# Altium schematic sheet MCP23017-1.SchDoc
size B
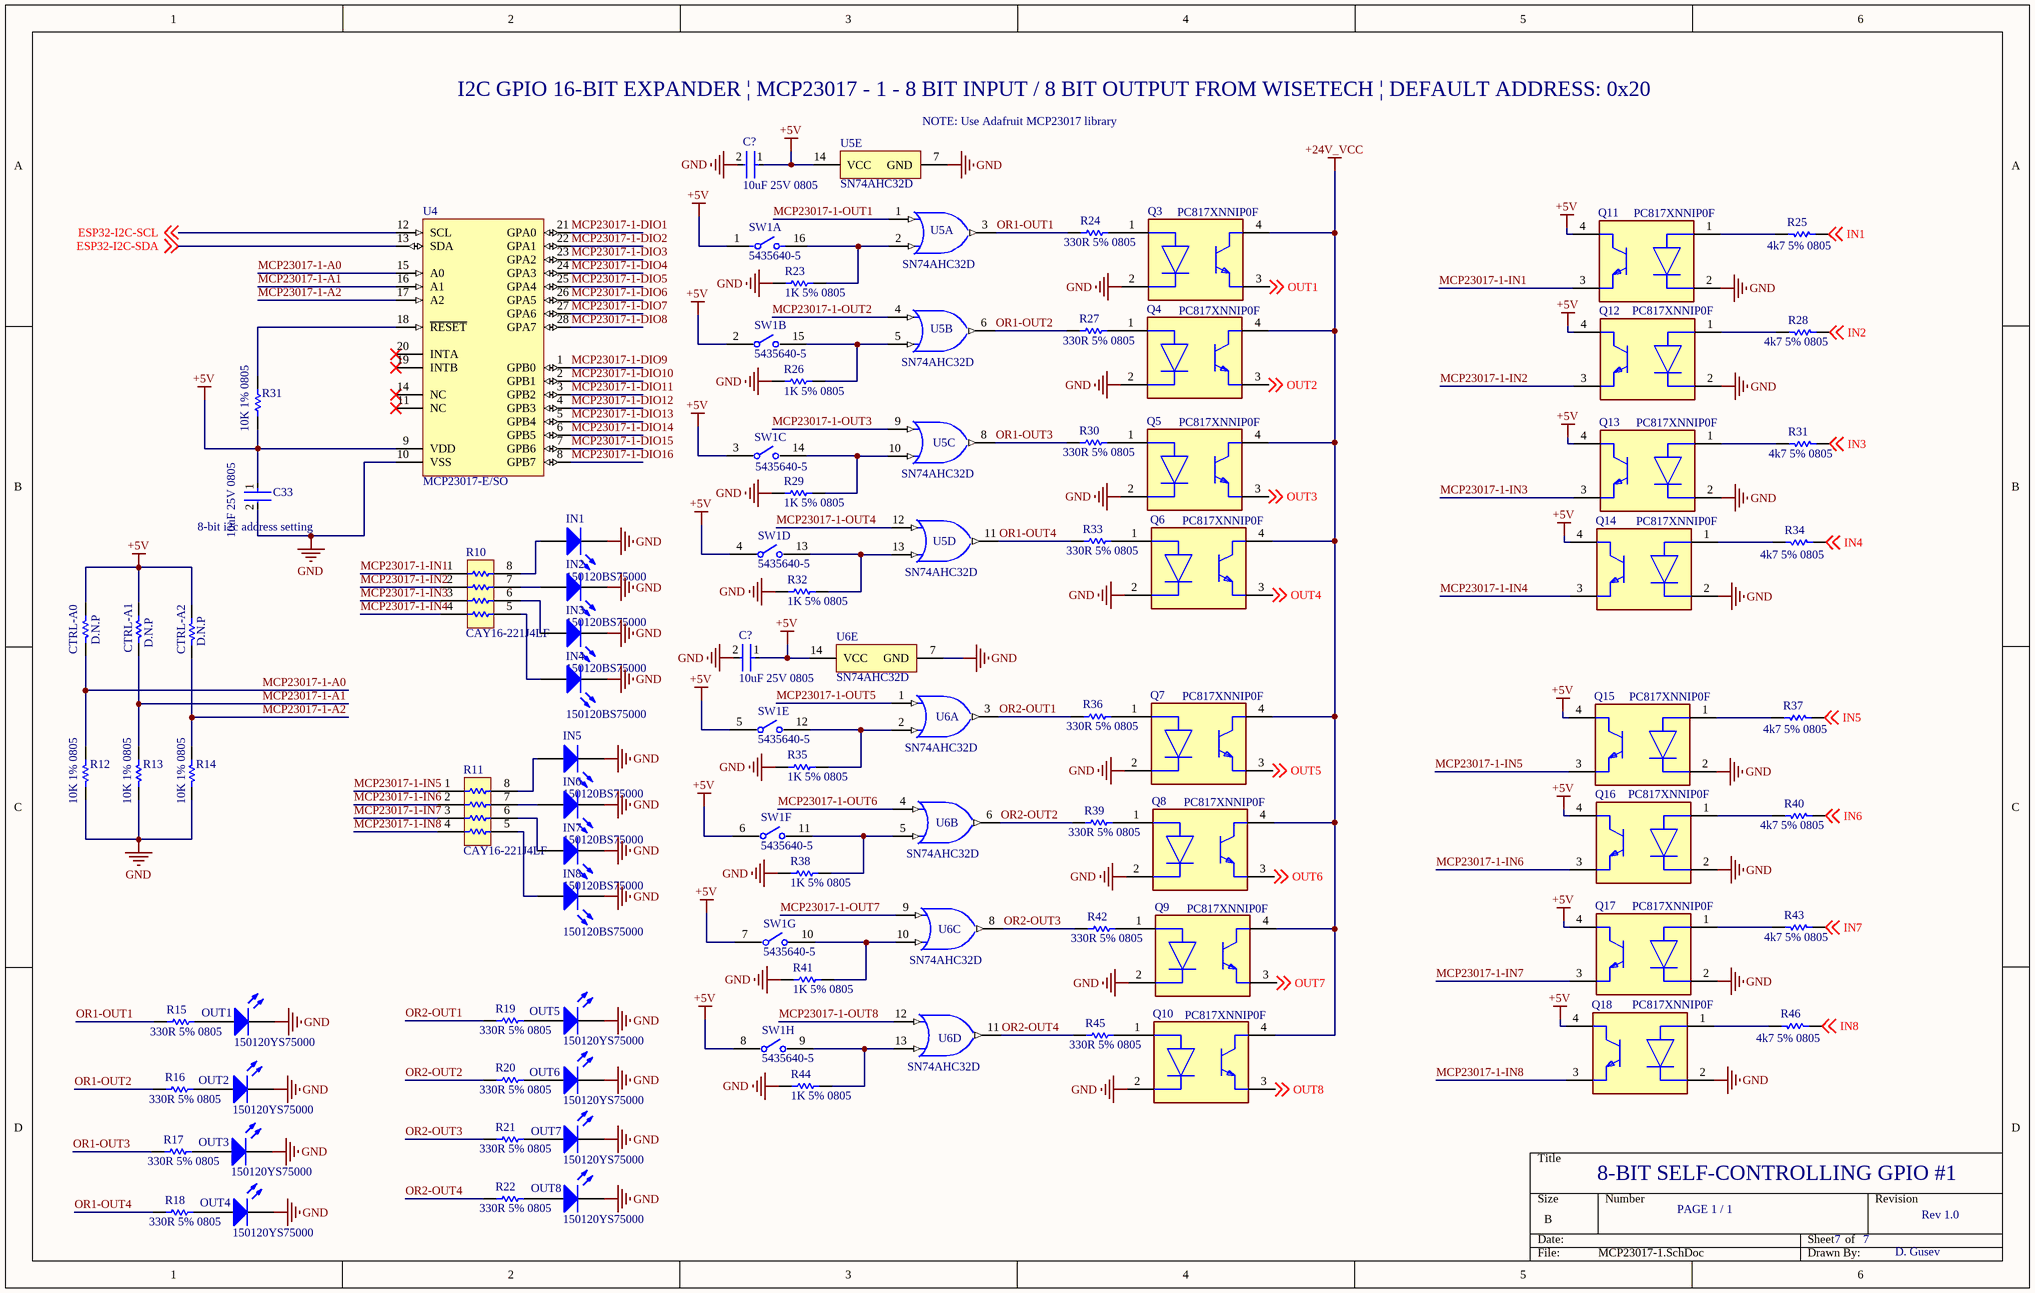
[diagram p0: MCP23017-1.SchDoc]

## Parts
(Parts that share a designator on the sheet are numbered #1, #2 ... from top to bottom, then left to right.)
C33  10uF 25V 0805  [FP-GRM21B-0_15-IPC_B]
C?#1  10uF 25V 0805  [FP-GRM21B-0_15-IPC_B]
C?#2  10uF 25V 0805  [FP-GRM21B-0_15-IPC_B]
CTRL-A0  D.N.P  [RESC2013X60X35LL10T20]
CTRL-A1  D.N.P  [RESC2013X60X35LL10T20]
CTRL-A2  D.N.P  [RESC2013X60X35LL10T20]
IN1  150120BS75000  [1206_A]
IN2  150120BS75000  [1206_A]
IN3  150120BS75000  [1206_A]
IN4  150120BS75000  [1206_A]
IN5  150120BS75000  [1206_A]
IN6  150120BS75000  [1206_A]
IN7  150120BS75000  [1206_A]
IN8  150120BS75000  [1206_A]
OUT1  150120YS75000  [1206_A]
OUT2  150120YS75000  [1206_A]
OUT3  150120YS75000  [1206_A]
OUT4  150120YS75000  [1206_A]
OUT5  150120YS75000  [1206_A]
OUT6  150120YS75000  [1206_A]
OUT7  150120YS75000  [1206_A]
OUT8  150120YS75000  [1206_A]
Q3  PC817XNNIP0F  [FP-PC817XNNIP0F-MFG]
Q4  PC817XNNIP0F  [FP-PC817XNNIP0F-MFG]
Q5  PC817XNNIP0F  [FP-PC817XNNIP0F-MFG]
Q6  PC817XNNIP0F  [FP-PC817XNNIP0F-MFG]
Q7  PC817XNNIP0F  [FP-PC817XNNIP0F-MFG]
Q8  PC817XNNIP0F  [FP-PC817XNNIP0F-MFG]
Q9  PC817XNNIP0F  [FP-PC817XNNIP0F-MFG]
Q10  PC817XNNIP0F  [FP-PC817XNNIP0F-MFG]
Q11  PC817XNNIP0F  [FP-PC817XNNIP0F-MFG]
Q12  PC817XNNIP0F  [FP-PC817XNNIP0F-MFG]
Q13  PC817XNNIP0F  [FP-PC817XNNIP0F-MFG]
Q14  PC817XNNIP0F  [FP-PC817XNNIP0F-MFG]
Q15  PC817XNNIP0F  [FP-PC817XNNIP0F-MFG]
Q16  PC817XNNIP0F  [FP-PC817XNNIP0F-MFG]
Q17  PC817XNNIP0F  [FP-PC817XNNIP0F-MFG]
Q18  PC817XNNIP0F  [FP-PC817XNNIP0F-MFG]
R10  CAY16-221J4LF  [BOUR-CAY16-J4_V]
R11  CAY16-221J4LF  [BOUR-CAY16-J4_V]
R12  10K 1% 0805  [RESC2013X60X35ML10T20]
R13  10K 1% 0805  [RESC2013X60X35ML10T20]
R14  10K 1% 0805  [RESC2013X60X35ML10T20]
R15  330R 5% 0805  [RESC2013X60X35LL10T20]
R16  330R 5% 0805  [RESC2013X60X35LL10T20]
R17  330R 5% 0805  [RESC2013X60X35LL10T20]
R18  330R 5% 0805  [RESC2013X60X35LL10T20]
R19  330R 5% 0805  [RESC2013X60X35LL10T20]
R20  330R 5% 0805  [RESC2013X60X35LL10T20]
R21  330R 5% 0805  [RESC2013X60X35LL10T20]
R22  330R 5% 0805  [RESC2013X60X35LL10T20]
R23  1K 5% 0805  [RESC2013X60X35ML10T20]
R24  330R 5% 0805  [RESC2013X60X35LL10T20]
R25  4k7 5% 0805  [YAGO-RC0805_M]
R26  1K 5% 0805  [RESC2013X60X35ML10T20]
R27  330R 5% 0805  [RESC2013X60X35LL10T20]
R28  4k7 5% 0805  [YAGO-RC0805_M]
R29  1K 5% 0805  [RESC2013X60X35ML10T20]
R30  330R 5% 0805  [RESC2013X60X35LL10T20]
R31#1  10K 1% 0805  [RESC2013X60X35ML10T20]
R31#2  4k7 5% 0805  [YAGO-RC0805_M]
R32  1K 5% 0805  [RESC2013X60X35ML10T20]
R33  330R 5% 0805  [RESC2013X60X35LL10T20]
R34  4k7 5% 0805  [YAGO-RC0805_M]
R35  1K 5% 0805  [RESC2013X60X35ML10T20]
R36  330R 5% 0805  [RESC2013X60X35LL10T20]
R37  4k7 5% 0805  [YAGO-RC0805_M]
R38  1K 5% 0805  [RESC2013X60X35ML10T20]
R39  330R 5% 0805  [RESC2013X60X35LL10T20]
R40  4k7 5% 0805  [YAGO-RC0805_M]
R41  1K 5% 0805  [RESC2013X60X35ML10T20]
R42  330R 5% 0805  [RESC2013X60X35LL10T20]
R43  4k7 5% 0805  [YAGO-RC0805_M]
R44  1K 5% 0805  [RESC2013X60X35ML10T20]
R45  330R 5% 0805  [RESC2013X60X35LL10T20]
R46  4k7 5% 0805  [YAGO-RC0805_M]
SW1  5435640-5  [FP-5435640-5-MFG]  (parts A,B,C,D,E,F,G,H of 8)
U4  MCP23017-E/SO  [SOIC-SO28_N]
U5  SN74AHC32D  [D0014A_M]  (parts A,B,C,D,E of 5)
U6  SN74AHC32D  [D0014A_M]  (parts A,B,C,D,E of 5)

## Nets
+5V: C33.1 C?#1.1 C?#2.1 CTRL-A0.2 CTRL-A1.2 CTRL-A2.2 Q11.4(C) Q12.4(C) Q13.4(C) Q14.4(C) Q15.4(C) Q16.4(C) Q17.4(C) Q18.4(C) R31#1.1 SW1.1 SW1.2 SW1.3 SW1.4 SW1.5 SW1.6 SW1.7 SW1.8 U4.9(VDD) U5.14(VCC) U6.14(VCC)
+24V_VCC: Q3.4(C) Q4.4(C) Q5.4(C) Q6.4(C) Q7.4(C) Q8.4(C) Q9.4(C) Q10.4(C)
GND: C33.2 C?#1.2 C?#2.2 IN1.1(K) IN2.1(K) IN3.1(K) IN4.1(K) IN5.1(K) IN6.1(K) IN7.1(K) IN8.1(K) OUT1.1(K) OUT2.1(K) OUT3.1(K) OUT4.1(K) OUT5.1(K) OUT6.1(K) OUT7.1(K) OUT8.1(K) Q3.2(C) Q4.2(C) Q5.2(C) Q6.2(C) Q7.2(C) Q8.2(C) Q9.2(C) Q10.2(C) Q11.2(C) Q12.2(C) Q13.2(C) Q14.2(C) Q15.2(C) Q16.2(C) Q17.2(C) Q18.2(C) R12.2 R13.2 R14.2 R23.1 R26.1 R29.1 R32.1 R35.1 R38.1 R41.1 R44.1 U4.10(VSS) U5.7(GND) U6.7(GND)
ESP32-I2C-SCL: U4.12(SCL) ; off-sheet ESP32-I2C-SCL
ESP32-I2C-SDA: U4.13(SDA) ; off-sheet ESP32-I2C-SDA
IN1: R25.1 ; off-sheet IN1
IN2: R28.1 ; off-sheet IN2
IN3: R31#2.1 ; off-sheet IN3
IN4: R34.1 ; off-sheet IN4
IN5: R37.1 ; off-sheet IN5
IN6: R40.1 ; off-sheet IN6
IN7: R43.1 ; off-sheet IN7
IN8: R46.1 ; off-sheet IN8
MCP23017-1-A0: CTRL-A0.1 R12.1 U4.15(A0)
MCP23017-1-A1: CTRL-A1.1 R13.1 U4.16(A1)
MCP23017-1-A2: CTRL-A2.1 R14.1 U4.17(A2)
MCP23017-1-DIO1: U4.21(GPA0)
MCP23017-1-DIO2: U4.22(GPA1)
MCP23017-1-DIO3: U4.23(GPA2)
MCP23017-1-DIO4: U4.24(GPA3)
MCP23017-1-DIO5: U4.25(GPA4)
MCP23017-1-DIO6: U4.26(GPA5)
MCP23017-1-DIO7: U4.27(GPA6)
MCP23017-1-DIO8: U4.28(GPA7)
MCP23017-1-DIO9: U4.1(GPB0)
MCP23017-1-DIO10: U4.2(GPB1)
MCP23017-1-DIO11: U4.3(GPB2)
MCP23017-1-DIO12: U4.4(GPB3)
MCP23017-1-DIO13: U4.5(GPB4)
MCP23017-1-DIO14: U4.6(GPB5)
MCP23017-1-DIO15: U4.7(GPB6)
MCP23017-1-DIO16: U4.8(GPB7)
MCP23017-1-IN1: Q11.3(E) R10.1
MCP23017-1-IN2: Q12.3(E) R10.2
MCP23017-1-IN3: Q13.3(E) R10.3
MCP23017-1-IN4: Q14.3(E) R10.4
MCP23017-1-IN5: Q15.3(E) R11.1
MCP23017-1-IN6: Q16.3(E) R11.2
MCP23017-1-IN7: Q17.3(E) R11.3
MCP23017-1-IN8: Q18.3(E) R11.4
MCP23017-1-OUT1: U5.1(1A)
MCP23017-1-OUT2: U5.4(2A)
MCP23017-1-OUT3: U5.9(3A)
MCP23017-1-OUT4: U5.12(4A)
MCP23017-1-OUT5: U6.1(1A)
MCP23017-1-OUT6: U6.4(2A)
MCP23017-1-OUT7: U6.9(3A)
MCP23017-1-OUT8: U6.12(4A)
OR1-OUT1: R15.1 R24.1 U5.3(1Y)
OR1-OUT2: R16.1 R27.1 U5.6(2Y)
OR1-OUT3: R17.1 R30.1 U5.8(3Y)
OR1-OUT4: R18.1 R33.1 U5.11(4Y)
OR2-OUT1: R19.1 R36.1 U6.3(1Y)
OR2-OUT2: R20.1 R39.1 U6.6(2Y)
OR2-OUT3: R21.1 R42.1 U6.8(3Y)
OR2-OUT4: R22.1 R45.1 U6.11(4Y)
OUT1: Q3.3(E) ; off-sheet OUT1
OUT2: Q4.3(E) ; off-sheet OUT2
OUT3: Q5.3(E) ; off-sheet OUT3
OUT4: Q6.3(E) ; off-sheet OUT4
OUT5: Q7.3(E) ; off-sheet OUT5
OUT6: Q8.3(E) ; off-sheet OUT6
OUT7: Q9.3(E) ; off-sheet OUT7
OUT8: Q10.3(E) ; off-sheet OUT8
NetIN1_2: IN1.2(A) R10.8
NetIN2_2: IN2.2(A) R10.7
NetIN3_2: IN3.2(A) R10.6
NetIN4_2: IN4.2(A) R10.5
NetIN5_2: IN5.2(A) R11.8
NetIN6_2: IN6.2(A) R11.7
NetIN7_2: IN7.2(A) R11.6
NetIN8_2: IN8.2(A) R11.5
NetOUT1_2: OUT1.2(A) R15.2
NetOUT2_2: OUT2.2(A) R16.2
NetOUT3_2: OUT3.2(A) R17.2
NetOUT4_2: OUT4.2(A) R18.2
NetOUT5_2: OUT5.2(A) R19.2
NetOUT6_2: OUT6.2(A) R20.2
NetOUT7_2: OUT7.2(A) R21.2
NetOUT8_2: OUT8.2(A) R22.2
NetQ3_1: Q3.1(A) R24.2
NetQ4_1: Q4.1(A) R27.2
NetQ5_1: Q5.1(A) R30.2
NetQ6_1: Q6.1(A) R33.2
NetQ7_1: Q7.1(A) R36.2
NetQ8_1: Q8.1(A) R39.2
NetQ9_1: Q9.1(A) R42.2
NetQ10_1: Q10.1(A) R45.2
NetQ11_1: Q11.1(A) R25.2
NetQ12_1: Q12.1(A) R28.2
NetQ13_1: Q13.1(A) R31#2.2
NetQ14_1: Q14.1(A) R34.2
NetQ15_1: Q15.1(A) R37.2
NetQ16_1: Q16.1(A) R40.2
NetQ17_1: Q17.1(A) R43.2
NetQ18_1: Q18.1(A) R46.2
NetR23_2: R23.2 SW1.16 U5.2(1B)
NetR26_2: R26.2 SW1.15 U5.5(2B)
NetR29_2: R29.2 SW1.14 U5.10(3B)
NetR31#1_2: R31#1.2 U4.18(~{RESET})
NetR32_2: R32.2 SW1.13 U5.13(4B)
NetR35_2: R35.2 SW1.12 U6.2(1B)
NetR38_2: R38.2 SW1.11 U6.5(2B)
NetR41_2: R41.2 SW1.10 U6.10(3B)
NetR44_2: R44.2 SW1.9 U6.13(4B)

Not connected (* = marked no-connect by the designer): U4 11(NC)* 14(NC)* 19(INTB)* 20(INTA)*

## Notes on the sheet
- I2C GPIO 16-BIT EXPANDER | MCP23017 - 1 - 8 BIT INPUT / 8 BIT OUTPUT FROM WISETECH | DEFAULT ADDRESS: 0x20
- (near U5) NOTE: Use Adafruit MCP23017 library
- 8-bit i2c address setting
- 8-BIT SELF-CONTROLLING GPIO #1
- PAGE 1 / 1
- 7
- Rev 1.0
- D. Gusev

## Library data of the parts
C33 C?#1 C?#2 = CMP-2007-03541-2: Chip Multilayer Ceramic Capacitors for General Purpose, 0805, 10uF, X5R, 15%, 10%, 25V; Length: 2mm; Depth: 1.25mm; Termination: SMD/SMT; Voltage: 25V; Height: 1.25mm; Material: Ceramic; Thickness: 0.053inch; Radiation Hardening: No; Min Operating Temperature: -55°C; Width: 0.049inch; Package Quantity: 1; Mount: Surface Mount; Dielectric: X5R; Packaging: Tape and Reel; Capacitance: 10uF; Voltage Rating (DC): 25V; Lead Free: Lead Free; Max Operating Temperature: 85°C; Case Code (Imperial): 0805; Case/Package: 0805; Tolerance: 10%; Voltage Rating: 25V; Case Code (Metric): 2012
CTRL-A0-CTRL-A2 = CMP-1659-00014-4: Chip Resistor, 1 Ohm, +/- 1%, 125 mW, -55 to 155 degC, 0805 (2012 Metric), RoHS, Tape and Reel; Manufacturer: Yageo; Voltage Rating: 150 V; REACH SVHC: No SVHC; Mounting Technology: Surface Mount; RoHSCompliant: true; Packaging: Tape and Reel; ComponentLink2URL: http://www.yageo.com/documents/recent/PYu-RC_Group_51_RoHS_L_04.pdf; Pins: 2; Package Quantity: 5000; DatasheetVersion: Rev. 4, 02/2016; Mount: Surface Mount; Max Operating Temperature: 155 degC; PackageDescription: 2-Pin Surface Mounted Device, Body 2 x 1.25 mm; PackageReference: 0805; Length: 2 mm; Min Operating Temperature: -55 degC; ComponentLink1URL: http://www.yageo.com/; Height: 0.5 mm; ComponentLink1Description: Manufacturer URL; ComponentLink2Description: Datasheet
IN1-IN8 = CMP-1426-00015-1: SMD mono-color Chip LED, WL-SMCW, Blue; Manufacturer: Wuerth Elektronik; ComponentLink2Description: Datasheet; ComponentLink1URL: http://www.we-online.com; PartNumber: 150120BS75000; ComponentLink1Description: Manufacturer URL; ComponentLink2URL: http://katalog.we-online.com/led/datasheet/150120BS75000.pdf; PackageReference: 1206_A; Color: Blue
OUT1-OUT8 = CMP-1426-00019-1: SMD mono-color Chip LED, WL-SMCW, Yellow; Manufacturer: Wuerth Elektronik; ComponentLink2URL: http://katalog.we-online.com/led/datasheet/150120YS75000.pdf; PartNumber: 150120YS75000; ComponentLink1URL: http://www.we-online.com; Color: Yellow; ComponentLink1Description: Manufacturer URL; PackageReference: 1206_A; ComponentLink2Description: Datasheet
Q3-Q18 = CMP-65434-000005-1: OPTOISOLATOR 5KV TRANS 4SMD; Reverse Breakdown Voltage: 6V; Output Current per Channel: 30mA; Power Dissipation: 200mW; Collector-emitter Voltage-Max: 200mV; Max Output Voltage: 80V; Input Current: 50mA; Forward Voltage: 1.4V; Fall Time: 18000ns; Number of Elements: 1; Input Type: DC; Packaging: Tape and Reel; RoHS Compliant: Yes; Contact Plating: Copper; Min Operating Temperature: -30°C; Collector Emitter Saturation Voltage: 200mV; Max Input Current: 50mA; Radiation Hardening: No; Max Collector Current: 50mA; Case/Package: SMD/SMT; Mount: Surface Mount; Output Voltage: 80V; Forward Current: 50mA; Max Power Dissipation: 200mW; Collector Emitter Voltage (VCEO): 80V; Number of Channels: 1; Rise Time: 18000ns; Isolation Voltage: 5kV; Number of Pins: 4; Lead Free: Lead Free; Package Quantity: 2000; Isolation Voltage-Max: 5kV; Max Operating Temperature: 100°C
R10 R11 = CMP-1747-00006-1: Chip Resistor Array, 220 Ohm, +/- 5%, 62.5 mW, -55 to 125 degC, 8-Pin SMD, RoHS, Tape and Reel; Resistance: 562 kohm; Tolerance: 1%; Case\Package: 0603; Power Rating: 100 mW; Voltage Rating: 50 V; Max Operating Temperature: 155 degC; ComponentLink2Description: Datasheet; ComponentLink1Description: Manufacturer URL; Height: 0.45 mm; Min Operating Temperature: -55 degC; Length: 1.6 mm; DatasheetVersion: Sep-14; ComponentLink1URL: http://www.bourns.com/; ComponentLink2URL: http://www.bourns.com/pdfs/CATCAY.pdf; Case Code (Imperial): 0603; PackageReference: CAY16-J4; Packaging: Tape and Reel; Case Code (Metric): 1608; RoHSCompliant: true; PackageDescription: 8-Pin Surface Mount Device, Body 1.6 x 3.2 mm, Pitch 0.8 mm
R12-R14 R31#1 = CMP-2000-05025-1: Chip Resistor, 10 KOhm, +/- 5%, 0.125 W, -55 to 155 degC, 0805 (2012 Metric), RoHS, Tape and Reel; Manufacturer: Yageo; Resistor Element Type: ThickFilm; Voltage Rating: 150V; Product Range: RCSeries; SVHC: ToBeAdvised; Resistor Case Style: 0805[2012Metric]; Temperature Coefficient: ±100ppm/degC; Power Rating: 250mW; Resistance: 10kohm; Automotive Qualification Standard: -; Datasheet Version: REV. 2, 09/2004; Packaging: CutTape; Resistance Tolerance: ±5%; MSL: MSL1-Unlimited; Manufacturer URL: http://www.yageo.com/; Datasheet URL: http://www.yageo.ru/pdf/RC0805.pdf; Package Description: 2-Pin Surface Mounted Device, Body 2 x 1.25 mm; Package Reference: 805
R15-R22 R24 R27 R30 R33 R36 R39 R42 R45 = CMP-2000-06960-1: Chip Resistor, 330 Ohm, +/- 1%, 125 mW, -55 to 155 degC, 0805 (2012 Metric), RoHS, Tape and Reel; Manufacturer: Yageo; Voltage Rating: 150V; Temperature Coefficient: 100PPM/C; Power Rating: 125mW(1/8W); Resistance: 330Ohms; Datasheet Version: Rev. 7, 05/2017; Termination Style: SMD/SMT; Case Code - mm: 2012; Package Description: 2-Pin Surface Mounted Device, Body 2 x 1.25 mm; Operating Temperature Range: -55Cto+155C; Case Code - in: 0805; Packaging: Reel; Tolerance: 1%; Package Reference: 0805; Mounting Technology: SurfaceMount; Product: ThickFilmResistorsGeneralPurpose; Series: RC; Manufacturer URL: http://www.yageo.com/; Datasheet URL: http://www.yageo.com/documents/recent/PYu-RC_Group_51_RoHS_L_7.pdf
R23 R26 R29 R32 R35 R38 R41 R44 = CMP-2100-03671-1: Chip Resistor, 1 KOhm, +/- 1%, 125 mW, -55 to 155 degC, 0805 (2012 Metric), RoHS, Tape and Reel; Manufacturer: Yageo; Temperature Coefficient: 100ppm/degreesC; Voltage Rating (DC): 150V; Max Power Dissipation: 125mW; Resistance: 1KOhm; Number of Pins: 2; Number of Terminations: 2; Datasheet URL: http://www.yageo.com/NewPortal/yageodocoutput?fileName=/pdf/R-Chip/PYu-RC_Group_51_RoHS_L_5.pdf; Length: 0.079inch; Package Description: 2-Pin Surface Mounted Device, Body 2 x 1.25 mm; Depth: 1.25mm; Height: 0.024inch; Military Standard: Not; Case/Package: 0805; Package Reference: 0805; RoHSCompliant: true; Lead Free: LeadFree; Packaging: TapeandReel; Package Quantity: 1; Datasheet Version: Rev. 5, 10/2016; Tolerance: 1%; Min Operating Temperature: -55degC; Voltage Rating: 150V; Composition: ThickFilm; Case Code (Imperial): 0805; Power Rating: 125mW; Width: 0.049inch; Case Code (Metric): 2012; Manufacturer URL: http://www.yageo.com/; Max Operating Temperature: 155degC; REACH SVHC: Unknown; Termination: SMD/SMT
R25 R28 R31#2 R34 R37 R40 R43 R46 = CMP-1568-00001-1: General Puprose Chip Resistor, 4700 Ohm +/- 1%, 0.125 W, -55 to 155 degC, 2-Pin SMD, RoHS, Tape and Reel; PartNumber: RC0805FR-074K7L; Tolerance: +/- 1%; Power: 0.125 W; PackageDescription: 2-Pin Surface Mount Device, Body 2 x 1.25 mm; ComponentLink2URL: http://www.yageo.com/documents/recent/PYu-RC_Group_51_RoHS_L-3.pdf; Temperature Min: -55 degC; Packing: Tape and Reel; Mounting Technology: Surface Mount; ComponentLink1URL: http://www.yageo.com/NewPortal/_en/index.jsp; Resistance: 4700 Ohm; Temperature Max: 155 degC; ComponentLink2Description: Datasheet; DatasheetVersion: Rev. 3; RoHS: TRUE; ComponentLink1Description: Manufacturer URL
SW1 = CMP-05209-000001-1: SWITCH ROCKER DIP SPST 60MA 5V; Contact Post Length: 0.14inch; Number of Switches: 8; Contact Resistance: 50mR; Actuator Material: Polyester; Pitch: 0.1inch; Sealable: No (Without); Actuator Length: 1.27mm; Contact Current Rating: 1A; Max Voltage Rating (DC): 24V; Washable: No; Voltage Rating (DC): 40V; Contact Plating: Gold; ELV: Compliant; Depth: 9.65mm; Height: 0.34inch; Length: 0.88inch; Housing Material: Polyester; Contact Material: Copper Alloy; Orientation: Straight; Series: 7100; Throw Configuration: SPST; RoHS Compliant: Yes; Case/Package: DIP; Radiation Hardening: No; Max Operating Temperature: 105°C; Lead Free: Lead Free; Current Rating: 60mA; Housing Color: Blue; Min Operating Temperature: -55°C; Actuator Type: Rocker; Package Quantity: 14; Number of Circuits: 8; Mount: Through Hole; Type: Switch; Terminal Pitch: 2.54mm; Termination: PC Pins; Packaging: Rail/Tube; Number of Positions: 8
U4 = CMP-0186-00161-2: 16-Bit I/O Expander with Serial Interface, 28-Pin SOIC, Extended Temperature; PackageReference: SOIC-SO28; ComponentLink2URL: http://ww1.microchip.com/downloads/en/DeviceDoc/21952b.pdf; PackageVersion: revBB, Aug-2009; ComponentLink1URL: http://www.microchip.com/; Code_JEDEC: MS-013; ComponentLink2Description: Datasheet; DatasheetVersion: revB, Feb-2007; PackageDescription: 28-Lead Plastic Small Outline (SO) - Wide 7.50mm Body [SOIC]; ComponentLink3Description: Package Specification; ComponentLink1Description: Manufacturer URL; RevisionNote: URLs added.; ComponentLink3URL: http://www.microchip.com/stellent/groups/techpub_sg/documents/packagingspec/en012702.pdf
U5 U6 = CMP-1573-00034-3: Quadruple 2-Input Positive-OR Gates, D0014A, TUBE; Manufacturer: Texas Instruments; Input Type: CMOS; VCC(Max)(V): 5.5; tpd @ Nom Voltage(Max)(ns): 13,8.5; F @ Nom Voltage(Max)(Mhz): 70; VCC(Min)(V): 2; Bits(#): 4; ICC @ Nom Voltage(Max)(mA): 0.02; Rating: Catalog; Output Drive (IOL/IOH)(Max)(mA): 50/-50; Voltage(Nom)(V): 3.3,5; Operating Temperature Range(C): -40 to 125; DatasheetVersion: SCLS247I; Output Type: CMOS; PackageVersion: http://www.ti.com/lit/ml/mpds177g/mpds177g.pdf; Code_JEDEC: MS-012; Generic Part Number: SN74AHC32; PackageReference: D0014A